# Altium schematic sheet mcu.SchDoc
size A3
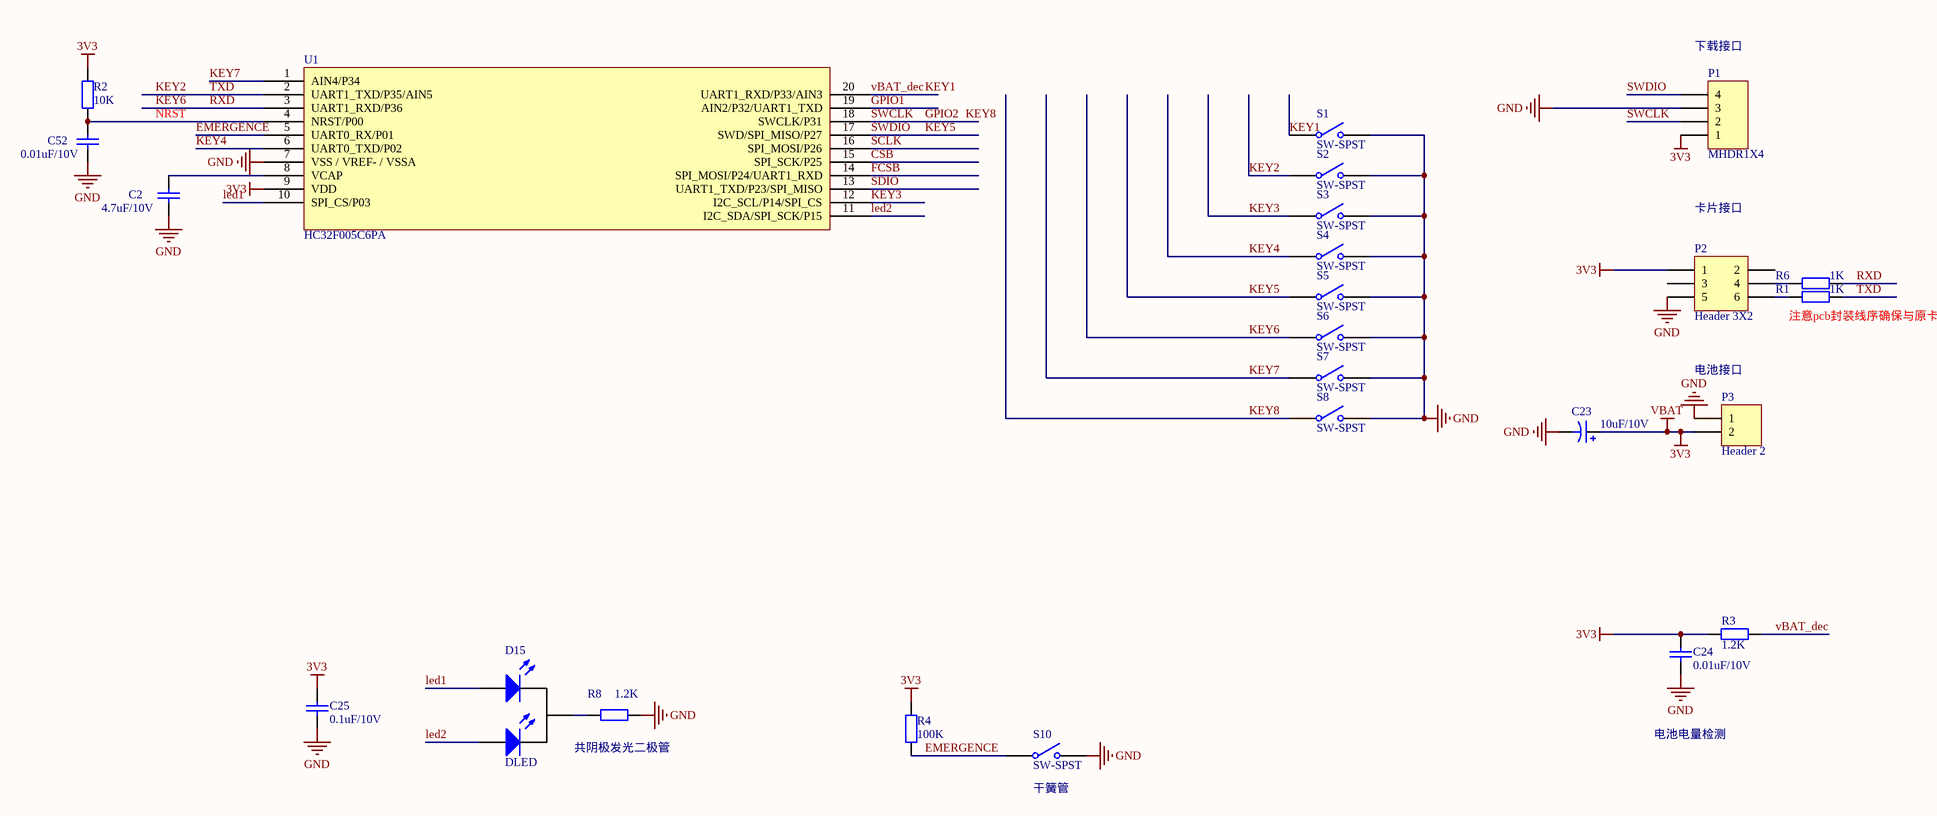
[diagram p0: mcu.SchDoc]

## Parts
C2  4.7uF/10V  [0603C]
C23  10uF/10V
C24  0.01uF/10V  [0603C]
C25  0.1uF/10V  [0603C]
C52  0.01uF/10V  [0603C]
D15  DLED
P1  MHDR1X4  [SIP4]
P2  Header 3X2
P3  Header 2
R1  1K  [0603R]
R2  10K  [0603R]
R3  1.2K  [0603R]
R4  100K  [0603R]
R6  1K  [0603R]
R8  1.2K  [0603R]
S1  SW-SPST
S2  SW-SPST
S3  SW-SPST
S4  SW-SPST
S5  SW-SPST
S6  SW-SPST
S7  SW-SPST
S8  SW-SPST
S10  SW-SPST
U1  HC32F005C6PA

## Nets
3V3: C23.1 C24.1 C25.1 P1.1 P2.1 P3.2 R2.2 R3.2 R4.1 U1.9(VDD)  [also labelled VBAT]
GND: C2.2 C23.2 C24.2 C25.2 C52.2 P1.3 P2.5 P3.1 R8.1 S1.2(NO) S2.2(NO) S3.2(NO) S4.2(NO) S5.2(NO) S6.2(NO) S7.2(NO) S8.2(NO) S10.2(NO) U1.7(VSS_/_VREF-_/_VSSA)
CSB: U1.15(SPI_SCK/P25)
EMERGENCE: R4.2 S10.1(COMMON) U1.5(UART0_RX/P01)
FCSB: U1.14(SPI_MOSI/P24/UART1_RXD)
GPIO1: U1.19(AIN2/P32/UART1_TXD)
GPIO2: P1.2 S8.1(COMMON) U1.18(SWCLK/P31)  [also labelled KEY8, SWCLK]
KEY1: R3.1 S1.1(COMMON) U1.20(UART1_RXD/P33/AIN3)  [also labelled vBAT_dec]
KEY2: R1.1 S2.1(COMMON) U1.2(UART1_TXD/P35/AIN5)  [also labelled TXD]
KEY3: S3.1(COMMON) U1.12(I2C_SCL/P14/SPI_CS)
KEY4: S4.1(COMMON) U1.6(UART0_TXD/P02)
KEY5: P1.4 S5.1(COMMON) U1.17(SWD/SPI_MISO/P27)  [also labelled SWDIO]
KEY6: R6.1 S6.1(COMMON) U1.3(UART1_RXD/P36)  [also labelled RXD]
KEY7: S7.1(COMMON) U1.1(AIN4/P34)
led1: D15.1(A) U1.10(SPI_CS/P03)
led2: D15.3(A) U1.11(I2C_SDA/SPI_SCK/P15)
NRST: C52.1 R2.1 U1.4(NRST/P00)
SCLK: U1.16(SPI_MOSI/P26)
SDIO: U1.13(UART1_TXD/P23/SPI_MISO)
NetC2_1: C2.1 U1.8(VCAP)
NetD15_2: D15.2(K) R8.2
NetP2_4: P2.4 R6.2
NetP2_6: P2.6 R1.2

Not connected (* = marked no-connect by the designer): P2 2 3

## Notes on the sheet
- (near P1) 下载接口
- 卡片接口
- (near R1) 注意pcb封装线序确保与原卡片接口一致
- (near P3) 电池接口
- 共阴极发光二极管
- 电池电量检测
- (near S10) 干簧管

## Library data of the parts
C2 C24 C25 C52 = Cap: Capacitor; Value: 106; Published: 8-Jun-2000; LatestRevisionDate: 17-Jul-2002; LatestRevisionNote: Re-released for DXP Platform.; PackageReference: RAD-0.3; Publisher: Altium Limited
C23 = Cap Pol1: Polarized Capacitor (Radial); Value: 100pF; Published: 8-Jun-2000; LatestRevisionDate: 17-Jul-2002; LatestRevisionNote: Re-released for DXP Platform.; PackageReference: RB7.6-15; Publisher: Altium Limited
P1 = MHDR1X4: Header, 4-Pin; LatestRevisionDate: 17-Jul-2002; LatestRevisionNote: Re-released for DXP Platform.; Publisher: Altium Limited
P2 = Header 3X2: Header, 3-Pin, Dual row; LatestRevisionDate: 17-Jul-2002; LatestRevisionNote: Re-released for DXP Platform.; Publisher: Altium Limited
P3 = Header 2: Header, 2-Pin; LatestRevisionDate: 17-Jul-2002; LatestRevisionNote: Re-released for DXP Platform.; Publisher: Altium Limited
R1-R4 R6 R8 = Res2: Resistor; Value: 10K/5%/1/8W; Published: 8-Jun-2000; LatestRevisionDate: 17-Jul-2002; LatestRevisionNote: Re-released for DXP Platform.; PackageReference: AXIAL-0.4; Publisher: Altium Limited
S1-S8 S10 = SW-SPST: Single-Pole, Single-Throw Switch; Published: 24-Mar-1999; LatestRevisionDate: 17-Jul-2002; LatestRevisionNote: Re-released for DXP Platform.; PackageReference: SPST-2; Publisher: Altium Limited